# EAGLE design PCB (EAGLE 7.2.0)
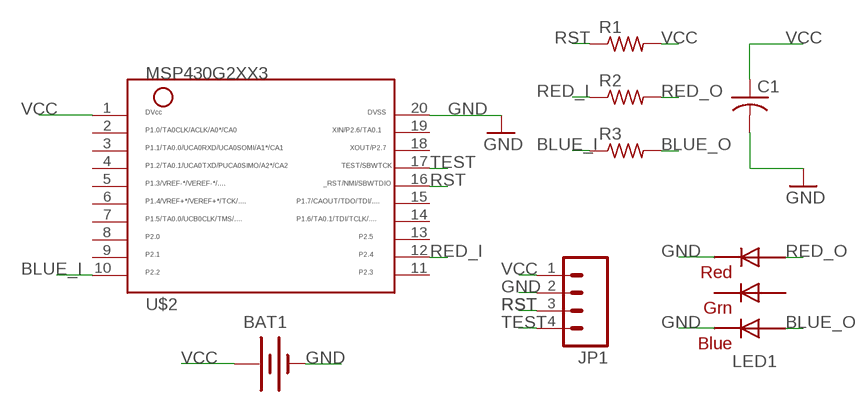
[diagram p0: schematic, sheet 1]

## Parts
BAT1  BATTERYBU2032SM  [BU2032SM]
C1  C-USC1206  [C1206]
JP1  M04LOCK  [1X04_LOCK]
LED1  RGBLED5050  [RGBLED5050]
R1  R-US_R1206  [R1206]
R2  R-US_R1206  [R1206]
R3  R-US_R1206  [R1206]
U$2  MSP430G2XX3TSSOP  [PW20]

## Nets
BLUE_I: R3.1 U$2.10
BLUE_O: LED1.3(BLUE_A) R3.2
GND: BAT1.P$2(-) C1.2 JP1.2 LED1.4(BLUE_C) LED1.5(RED_C) U$2.20
RED_I: R2.1 U$2.12
RED_O: LED1.2(RED_A) R2.2
RST: JP1.3 R1.1 U$2.16
TEST: JP1.4 U$2.17
VCC: BAT1.P$1(+) C1.1 JP1.1 R1.2 U$2.1
Unconnected: LED1.1(GREEN_A) LED1.6(GREEN_C) U$2.2 U$2.3 U$2.4 U$2.5 U$2.6 U$2.7 U$2.8 U$2.9 U$2.11 U$2.13 U$2.14 U$2.15 U$2.18 U$2.19

## Library data of the parts
BAT1 = ELEC327:BATTERY: Battery Holders Various common sizes : AA, AAA, 20mm coin cell and 12mm coin cell. 20MM_4LEGS, BATT-10373
C1 = resistor:C-US: CAPACITOR, American symbol
JP1 = SparkFun:M04: Header 4 Standard 4-pin 0.1" header. Use with straight break away headers (SKU : PRT-00116), right angle break away headers (PRT-00553), swiss pins (PRT-00743), machine pins (PRT-00117), and female headers (PRT-00115). Molex polarized connector foot print use with SKU : PRT-08231 with associated crimp pins and housings.
LED1 = adafruit:RGBLED: For 5050 RGB LEDs, the order of the LEDs may vary from one manufacturer to another!
R1-R3 = resistor:R-US_: RESISTOR, American symbol
U$2 = ELEC327:MSP430G2XX3: MSP430G2XX3 PDIP (N) 20 Pin Package

## Board
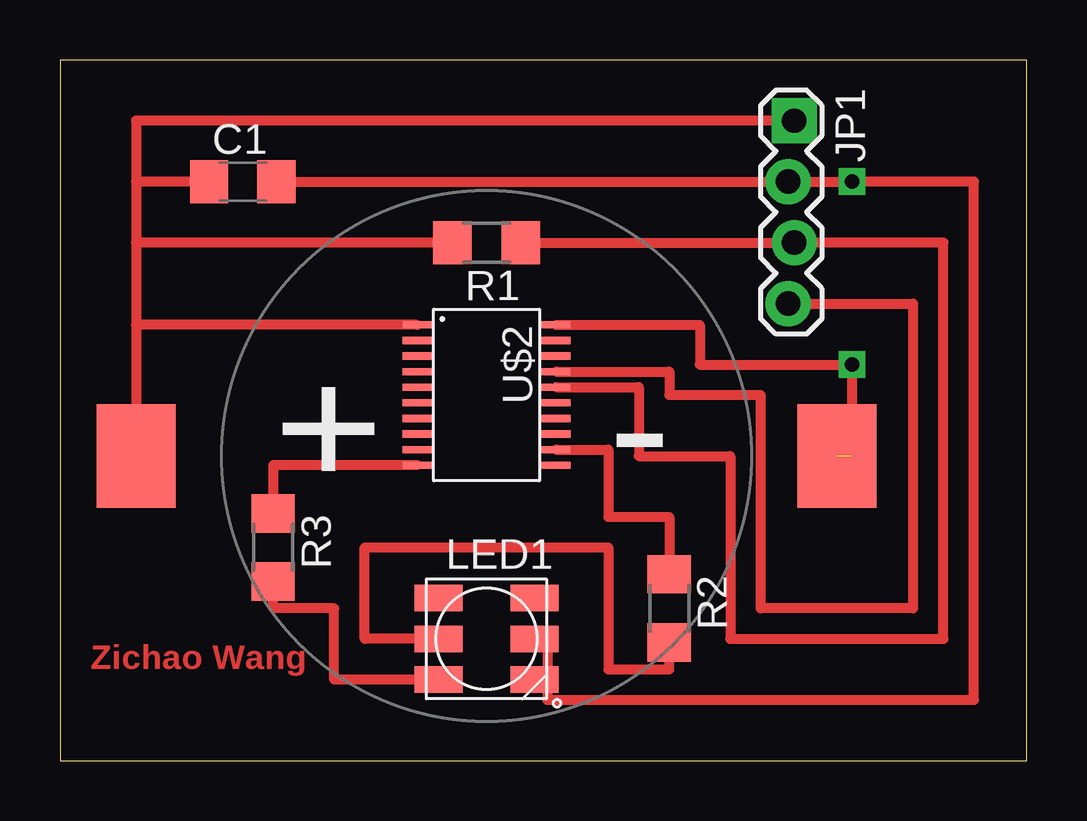
[diagram p1: board, top side]
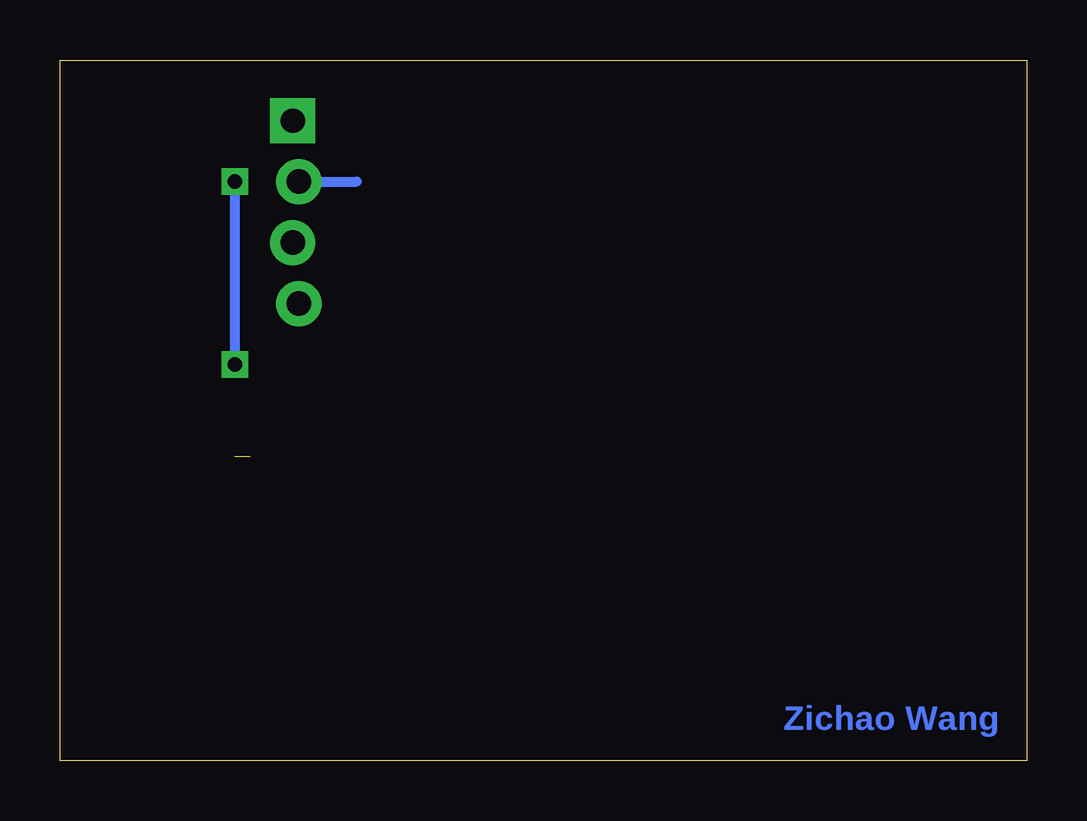
[diagram p2: board, bottom side, seen from below]

Size 40.31 x 29.2 mm. Coordinates in mm from the lower left corner, seen from the top.
Outline: 0,0 40.31,0 40.31,29.2 0,29.2 0,0
Copper layers (1*16): Top 0.035mm / dielectric 1.5mm / Bottom 0.035mm
Design rules "AdvancedCircuitsBarebones": minimum track width 6mil, minimum drill 20mil, track to track 6mil, track to pad 6mil, pad to pad 6mil, via to via 6mil, smd to smd 6mil, copper to edge 10mil, drill to drill 6mil, minimum pad ring 12mil, minimum via ring 10mil, stop-mask expansion 4mil, vias tented up to drill 25mil, thermal gap 10mil

### Footprints (pad centres in the part's own frame; a part is rotated, then mirrored left to right if it is on the bottom)
BU2032SM = smd 3.302 x 4.318: P$1 -14.605,0; P$2 14.605,0
C1206 = smd 1.6 x 1.8: 1 -1.4,0; 2 1.4,0
1X04_LOCK = drill 1.016 pad 1.88 square: 1 0,0.127 | drill 1.016 pad 1.88: 2 2.54,-0.127; 3 5.08,0.127; 4 7.62,-0.127
RGBLED5050 = smd 2 x 1.1: 1 -2,1.7; 2 -2,0; 3 -2,-1.7; 4 2,-1.7; 5 2,0; 6 2,1.7
R1206 = smd 1.6 x 1.803: 1 -1.422,0; 2 1.422,0
PW20 = smd 0.3 x 1.2: 1 -2.925,-2.9; 2 -2.275,-2.9; 3 -1.625,-2.9; 4 -0.975,-2.9; 5 -0.325,-2.9; 6 0.325,-2.9; 7 0.975,-2.9; 8 1.625,-2.9; 9 2.275,-2.9; 10 2.925,-2.9; 11 2.925,2.9; 12 2.275,2.9; 13 1.625,2.9; 14 0.975,2.9; 15 0.325,2.9; 16 -0.325,2.9; 17 -0.975,2.9; 18 -1.625,2.9; 19 -2.275,2.9; 20 -2.925,2.9

### Placement (x,y rotation side)
BAT1  17.78,12.7 0 top
C1  7.62,24.13 0 top
JP1  30.48,26.67 270 top
LED1  17.78,5.08 0 top
R1  17.78,21.59 180 top
R2  25.4,6.35 270 top
R3  8.89,8.89 270 top
U$2  17.78,15.24 270 top

### Tracks (layer width: path | path; a pad name or v marks a point on that pad's centre or on a via)
BLUE_I
  Top 0.406: U$2.10 8.89,12.32 R3.1
BLUE_O
  Top 0.406: LED1.3 11.43,3.38 11.43,6.35 8.89,6.35 R3.2
GND  (via drill 0.6)  (1 unrouted)
  Top 0.406: U$2.20 26.67,18.16 26.67,16.51 v33.02,16.51 33.02,12.7 | C1.2 JP1.2 v33.02,24.13 38.1,24.13 38.1,2.54 20.32,2.54 20.32,3.38 | LED1.4 20.32,3.38 | LED1.5 20.32,5.08 20.32,3.38
  Bottom 0.406: JP1.2 27.94,24.13 | v33.02,24.13 v33.02,16.51
RED_I
  Top 0.406: R2.1 25.4,10.16 22.86,10.16 22.86,12.96 U$2.12
RED_O
  Top 0.406: LED1.2 12.7,5.08 12.7,8.89 22.86,8.89 22.86,3.81 25.4,3.81 R2.2
RST
  Top 0.406: R1.1 JP1.3 36.83,21.59 36.83,5.08 27.94,5.08 27.94,12.7 24.13,12.7 24.13,15.57 U$2.16
TEST
  Top 0.406: U$2.17 25.4,16.21 25.4,15.24 29.21,15.24 29.21,6.35 35.56,6.35 35.56,19.05 JP1.4
VCC
  Top 0.406: C1.1 3.17,24.13 | 3.17,24.13 3.17,21.59 | 3.17,21.59 3.17,18.16 | 3.17,18.16 BAT1.P$1 | R1.2 3.17,21.59 | U$2.1 3.17,18.16 | JP1.1 3.17,26.67 3.17,24.13

### Text on the board
Top: Zichao Wang
Bottom: Zichao Wang